# EAGLE design Amiga Parallel SD Rev 3 (EAGLE 9.7.0)
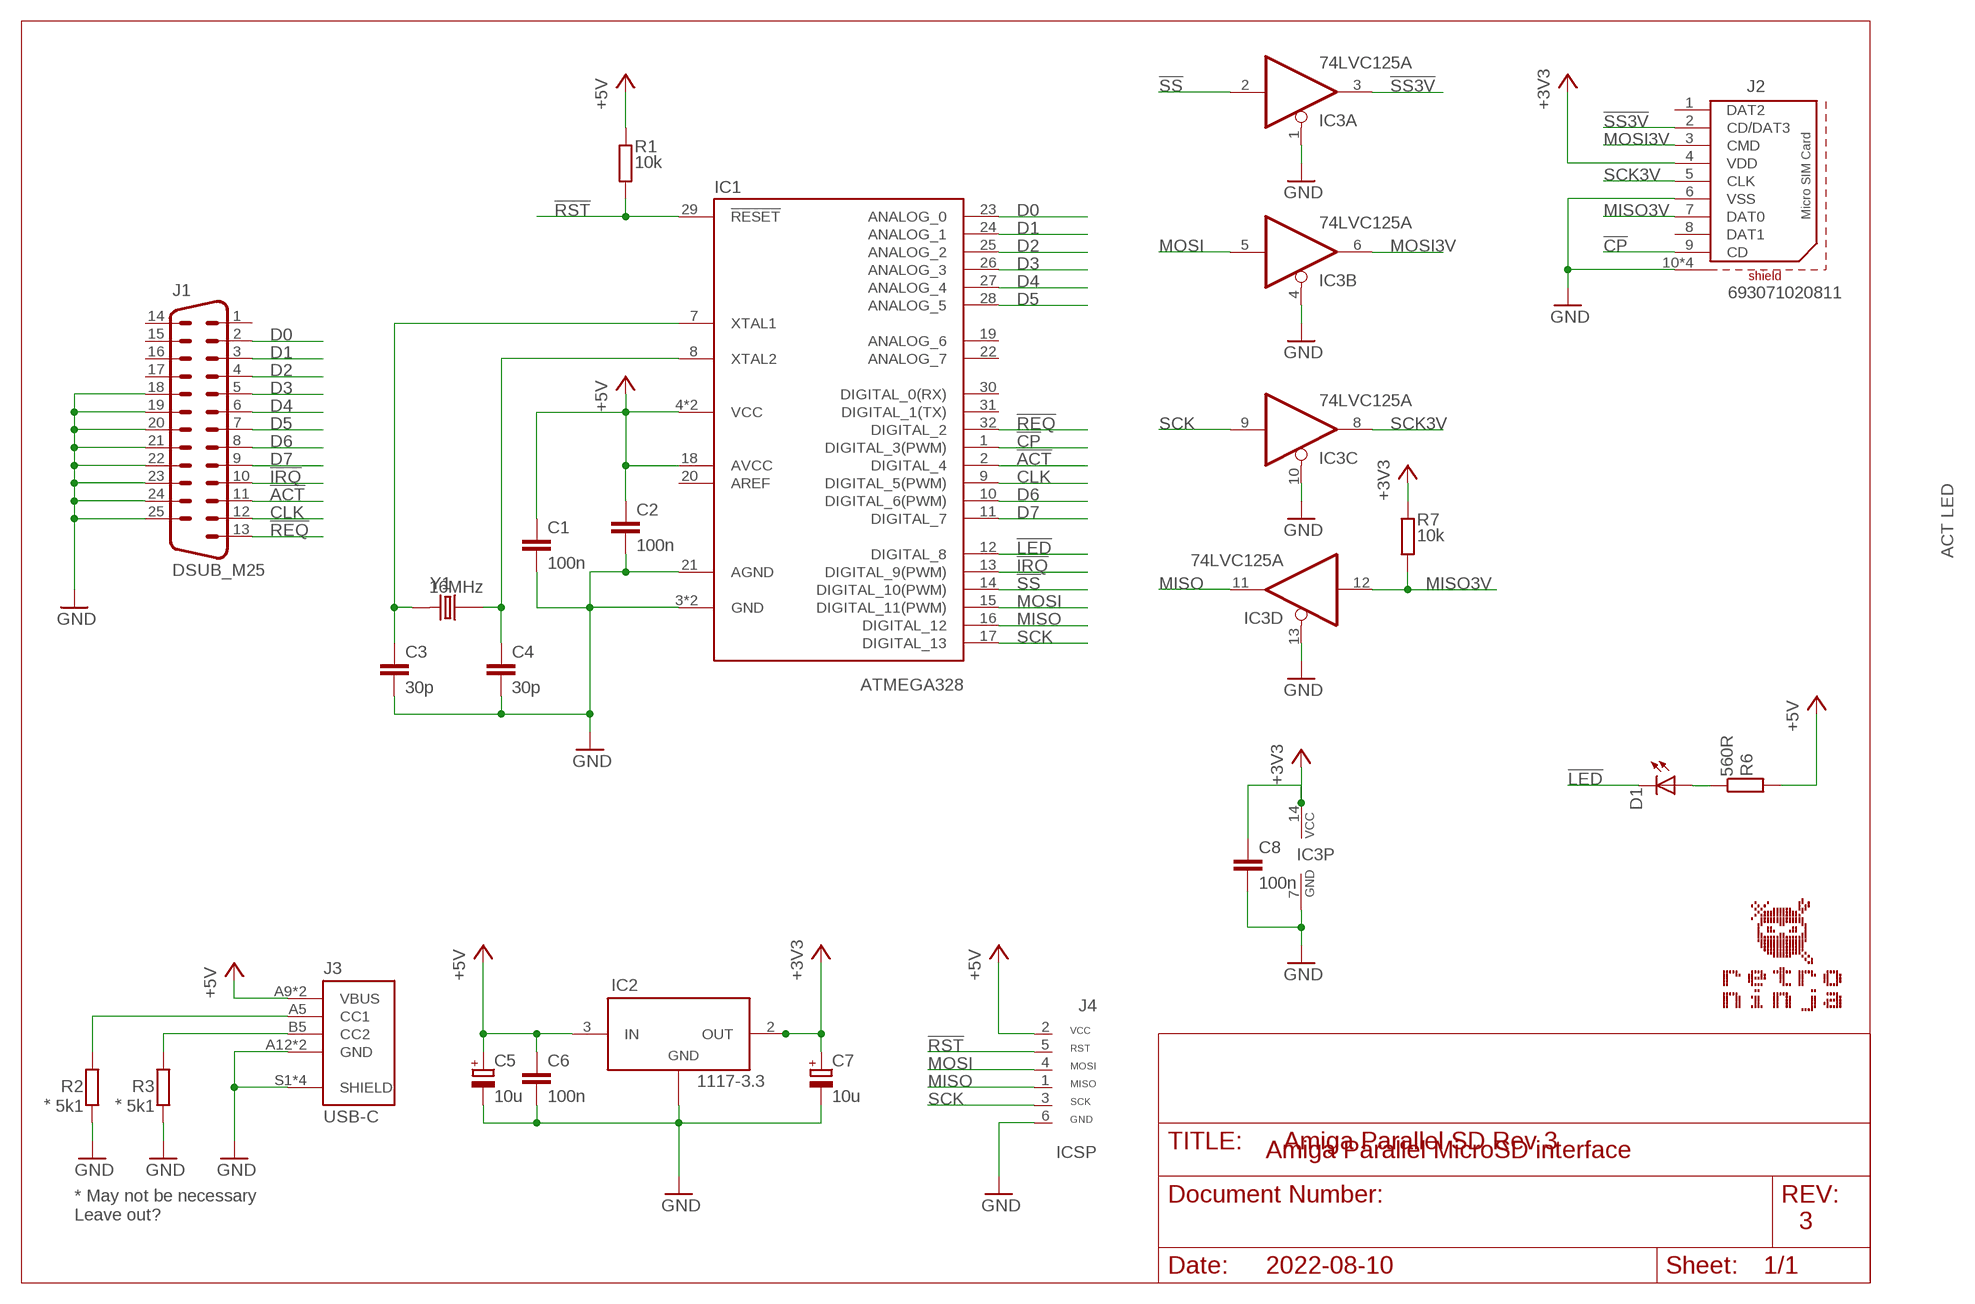
[diagram p0: schematic, sheet 1]

## Parts
C1  100n  C-EUC0805  [C0805]
C2  100n  C-EUC0805  [C0805]
C3  30p  C-EUC0805  [C0805]
C4  30p  C-EUC0805  [C0805]
C5  10u  CAPACITOR_POL_TANT_0805  [TANTALUM_0805]
C6  100n  C-EUC0805  [C0805]
C7  10u  CAPACITOR_POL_TANT_0805  [TANTALUM_0805]
C8  100n  C-EUC0805  [C0805]
D1  LED_3MM_GREEN  [LED3MM_GREEN]
IC1  ATMEGA328  ARDUINO_168_328_TQFP  [TQFP-32]
IC2  1117-3.3  NCP1117ST33T3G  [SOT-223]
IC3  74LVC125A  74HC125D  [SO14]
J1  DSUB_M25  [DSUB_M25D]
J2  693071020811  [693071020811]
J3  USB-C  [MOLEX_2171750001]
J4  ICSP  ICSP_CONNECTOR_6_ALT  [HEADER_2X3_ALT]
R1  10k  R-EU_R0805  [R0805]
R2  5k1  R-EU_R0805  [R0805]
R3  5k1  R-EU_R0805  [R0805]
R6  560R  R-EU_R0805  [R0805]
R7  10k  R-EU_R0805  [R0805]
Y1  16MHz  CRYSTAL  [CRYSTAL_SMD-2_7X4X2.3]

## Nets
!ACT: IC1.2(DIGITAL_4) J1.11
!CP: IC1.1(DIGITAL_3(PWM)) J2.9(CD)
!IRQ: IC1.13(DIGITAL_9(PWM)) J1.10
!LED: D1.K(C) IC1.12(DIGITAL_8)
!REQ: IC1.32(DIGITAL_2) J1.13
!RST: IC1.29(!RESET) J4.5(RST) R1.2
!SS: IC1.14(DIGITAL_10(PWM)) IC3.2(A:I)
!SS3V: IC3.3(A:O) J2.2(CD/DAT3)
+3V3: C7.+ C8.1 IC2.2(OUT) IC2.4 IC3.14(P:VCC) J2.4(VDD) R7.1
+5V: C1.1 C2.1 C5.+ C6.1 IC1.4(VCC) IC1.6(VCC) IC1.18(AVCC) IC2.3(IN) J3.A9(VBUS) J3.B9(VBUS) J4.2(VCC) R1.1 R6.2
A5: J3.A5(CC1) R2.2
B5: J3.B5(CC2) R3.2
CLK: IC1.9(DIGITAL_5(PWM)) J1.12
D0: IC1.23(ANALOG_0) J1.2
D1: IC1.24(ANALOG_1) J1.3
D2: IC1.25(ANALOG_2) J1.4
D3: IC1.26(ANALOG_3) J1.5
D4: IC1.27(ANALOG_4) J1.6
D5: IC1.28(ANALOG_5) J1.7
D6: IC1.10(DIGITAL_6(PWM)) J1.8
D7: IC1.11(DIGITAL_7) J1.9
GND: C1.2 C2.2 C3.2 C4.2 C5.- C6.2 C7.- C8.2 IC1.3(GND) IC1.5(GND) IC1.21(AGND) IC2.1(ADJ/GND) IC3.1(A:OE) IC3.4(B:OE) IC3.7(P:GND) IC3.10(C:OE) IC3.13(D:OE) J1.18 J1.19 J1.20 J1.21 J1.22 J1.23 J1.24 J1.25 J2.6(VSS) J2.10(SHIELD) J2.11(SHIELD) J2.12(SHIELD) J2.13(SHIELD) J3.A12(GND) J3.B12(GND) J3.S1(SHIELD) J3.S2(SHIELD) J3.S3(SHIELD) J3.S4(SHIELD) J4.6(GND) R2.1 R3.1
MISO: IC1.16(DIGITAL_12) IC3.11(D:O) J4.1(MISO)
MISO3V: IC3.12(D:I) J2.7(DAT0) R7.2
MOSI: IC1.15(DIGITAL_11(PWM)) IC3.5(B:I) J4.4(MOSI)
MOSI3V: IC3.6(B:O) J2.3(CMD)
N$2: D1.A R6.1
N$16: C4.1 IC1.8(XTAL2) Y1.1
N$17: C3.1 IC1.7(XTAL1) Y1.2
SCK: IC1.17(DIGITAL_13) IC3.9(C:I) J4.3(SCK)
SCK3V: IC3.8(C:O) J2.5(CLK)
Unconnected: IC1.19(ANALOG_6) IC1.20(AREF) IC1.22(ANALOG_7) IC1.30(DIGITAL_0(RX)) IC1.31(DIGITAL_1(TX)) J1.1 J1.14 J1.15 J1.16 J1.17 J2.1(DAT2) J2.8(DAT1)

## Notes on the sheet
- ACT LED
- * | *
- Amiga Parallel MicroSD interface
- * May not be necessary
  Leave out?
- 3
- 2022-08-10

## Library data of the parts
C1-C4 C6 C8 = rcl:C-EU: CAPACITOR, European symbol; SPICEPREFIX: C
C5 C7 = Per (Fusion 360):CAPACITOR_POL
D1 = Per (Fusion 360):LED
IC1 = Per (Fusion 360):ARDUINO_168_328
IC2 = IC:NCP1117ST33T3G: IC REG LINEAR 3.3V 1A SOT223 Manufacturer's datasheet <https://www.onsemi.com/pub/Collateral/NCP1117-D.PDF>; CREATED_BY: PCBLayout.com; DIGIKEY_PART_NUMBER: NCP1117ST33T3GOSTR-ND; MANUFACTURER: ON Semiconductor; MPN: NCP1117ST33T3G; PACKAGE: SOT-223
IC3 = 74xx-eu:74*125: Quad bus BUFFER, 3-state
J1 = Per (Fusion 360):DSUB_M25
J2 = Wurth_Connectors_WR-CRD:693071020811: WR-CRD Micro SD Card Connector Push & Push 8 pins KIND PROPERTIES Quality Class 10 000 Mating cycles Gender Socket Type Push & Push MATERIAL PROPERTIES Insulator Material LCP Insulator Flammability Rating UL94 V-0 Insulator Color Black Color Black Cover Material Stainless Steel Contact Material Copper Alloy Contact Plating Selective Gold;​ 1 u' on contact area Contact Type Stamped GENERAL INFORMATION Operating Temperature -25 up to +85 °C;​ -40 up to +85 °C Compliance RoHS ELECTRICAL PROPERTIES Working Voltage 100 V (AC);​ 30 V (AC) Withstanding Voltage 500 V (AC) Contact Resistance 100 mΩ Contact Resistance 500 mΩ Details see: https://katalog.we-online.com/en/em/CRD_SD_MICRO_PUSH_AND_PULL_8_PINS Created by Ella Wu 2019-11-05 2019(C) Wurth Elektronik; DATASHEET-URL: https://www.we-online.com/catalog/datasheet/693071020811.pdf; GERDER: Socket; IR: 0.5A; MOUNT: SMT; PART-NUMBER: 693071020811; PINS: 8; TYPE: Push & Push; WORKING-VOLTAGE: 30V(AC)
J3 = Per (Fusion 360):USB-C: Molex 2171750001 USB-C (USB TYPE-C) USB 2.0 Receptacle Connector 24 (6+18 Dummy) Position Surface Mount, Right Angle; Through Hole; MANUFACTURER: Molex; MAXIMUM_PACKAGE_HEIGHT: 3.16mm; PARTREV: A1; STANDARD: Manufacturer Recommendations
J4 = Per (Fusion 360):ICSP_CONNECTOR: PIN HEADER
R1-R3 R6 R7 = rcl:R-EU_: RESISTOR, European symbol; SPICEPREFIX: R
Y1 = Per (Fusion 360):CRYSTAL

## Board
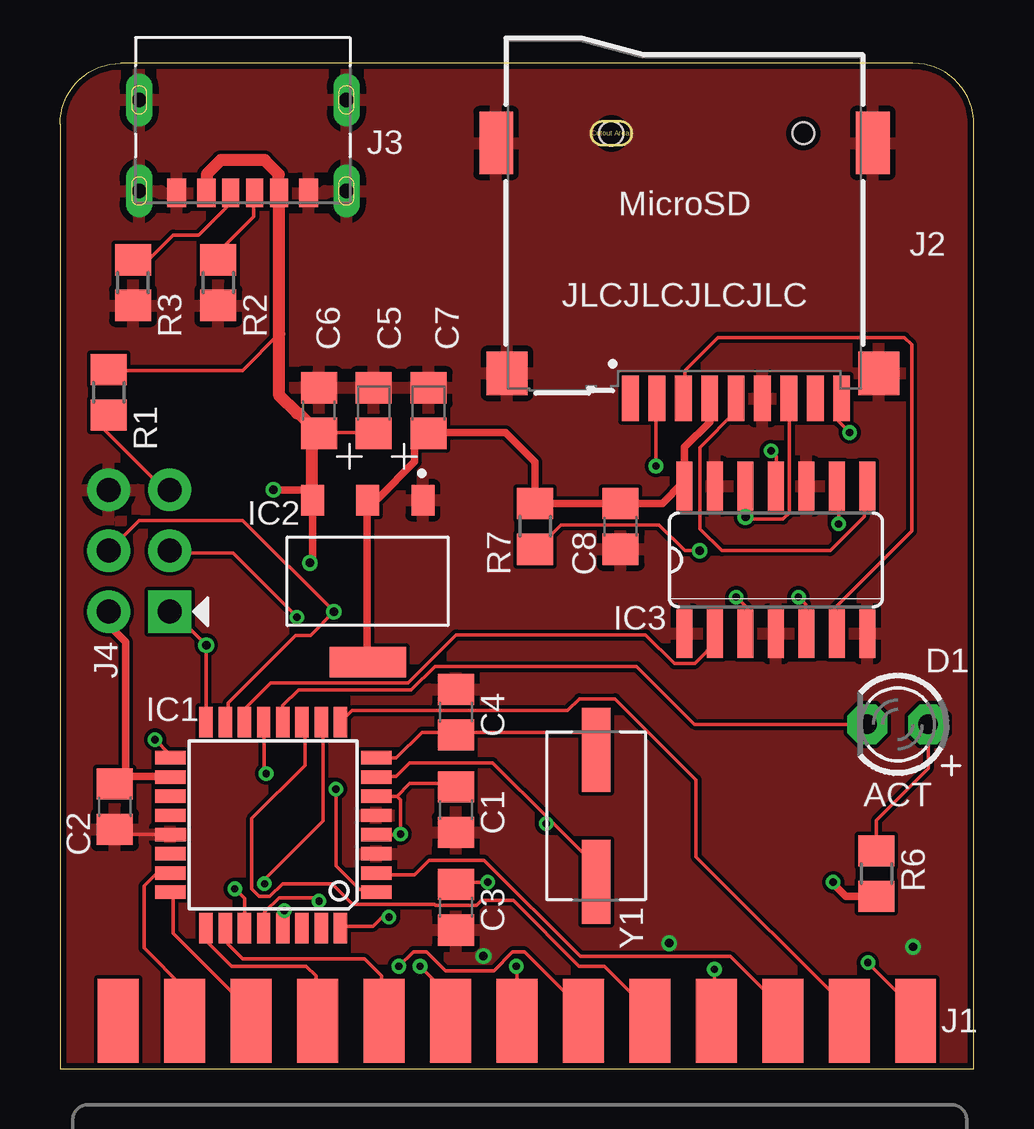
[diagram p1: board, top side]
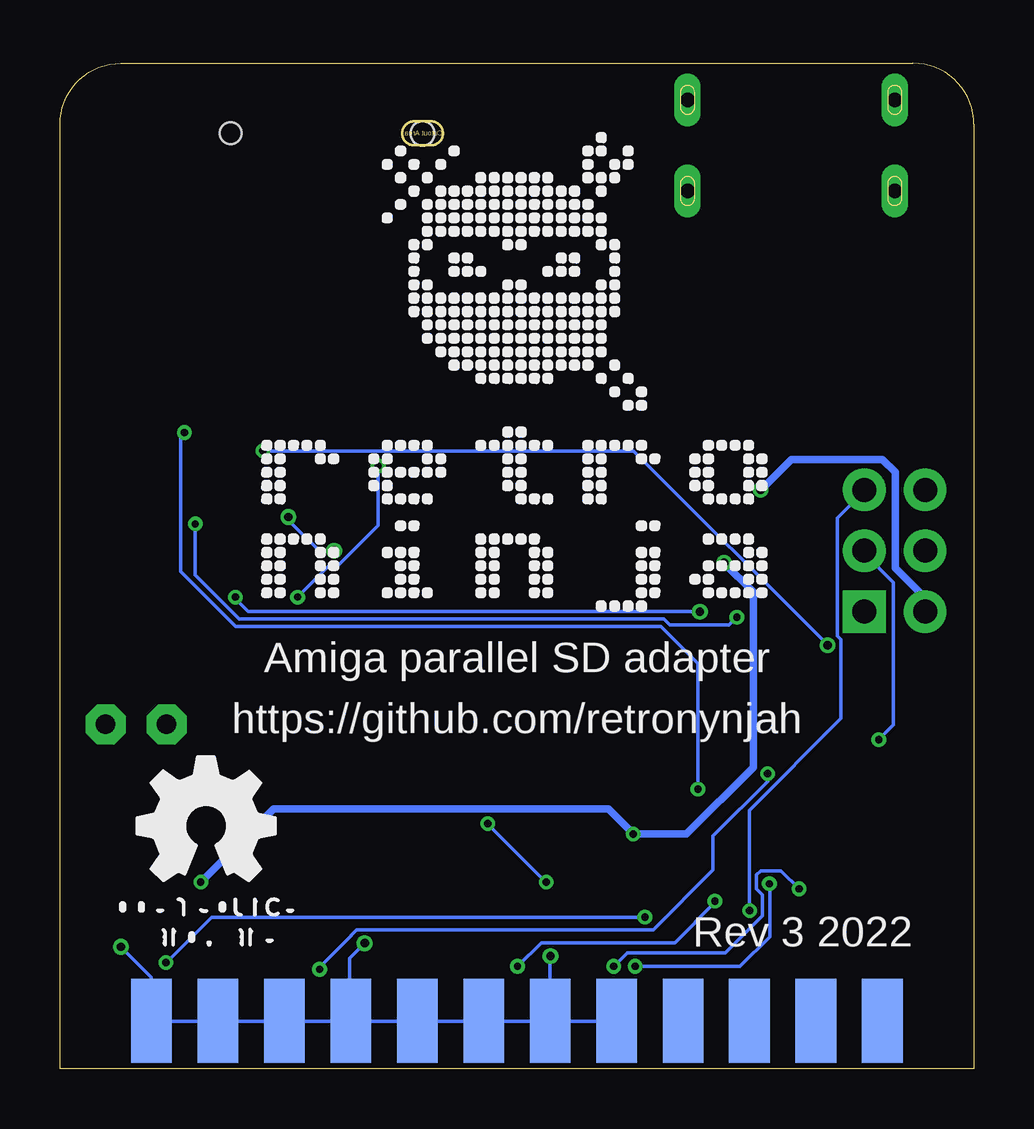
[diagram p2: board, bottom side, seen from below]

Size 38.1 x 41.91 mm. Coordinates in mm from the lower left corner, seen from the top.
Outline: 0,0 38.1,0 38.1,39.37 arc90 35.56,41.91 2.54,41.91 arc90 0,39.37 0,0
Copper layers (1*16): Top 0.035mm / dielectric 1.5mm / Bottom 0.035mm
Design rules "SeeedStudio_2layer_DRU_no_angle_20140221": minimum track width 6mil, minimum drill 12mil, track to track 6mil, track to pad 6mil, pad to pad 6mil, via to via 6mil, smd to smd 0mil, copper to edge 10mil, drill to drill 10mil, minimum pad ring 10mil, minimum via ring 6mil, stop-mask expansion 2mil, vias tented up to drill 100mil, thermal gap 10mil

### Footprints (pad centres in the part's own frame; a part is rotated, then mirrored left to right if it is on the bottom)
C0805 = smd 1.3 x 1.5: 1 -0.95,0; 2 0.95,0
TANTALUM_0805 = smd 1.3 x 1.5: + -0.95,0; - 0.95,0
LED3MM_GREEN = drill 0.813 pad 1.676 octagon: A -1.27,0; K 1.27,0
TQFP-32 = smd 1.27 x 0.559: 1 -4.293,2.8; 2 -4.293,2; 3 -4.293,1.2; 4 -4.293,0.4; 5 -4.293,-0.4; 6 -4.293,-1.2; 7 -4.293,-2; 8 -4.293,-2.8; 17 4.293,-2.8; 18 4.293,-2; 19 4.293,-1.2; 20 4.293,-0.4; 21 4.293,0.4; 22 4.293,1.2; 23 4.293,2; 24 4.293,2.8 | smd 0.559 x 1.27: 9 -2.8,-4.293; 10 -2,-4.293; 11 -1.2,-4.293; 12 -0.4,-4.293; 13 0.4,-4.293; 14 1.2,-4.293; 15 2,-4.293; 16 2.8,-4.293; 25 2.8,4.293; 26 2,4.293; 27 1.2,4.293; 28 0.4,4.293; 29 -0.4,4.293; 30 -1.2,4.293; 31 -2,4.293; 32 -2.8,4.293
SOT-223 = smd 1.26 x 0.96: 1 -3.375,2.3; 2 -3.375,0; 3 -3.375,-2.3 | smd 1.26 x 3.19: 4 3.375,0
SO14 = smd 0.66 x 2.032: 1 -3.81,-3.073; 2 -2.54,-3.073; 3 -1.27,-3.073; 4 0,-3.073; 5 1.27,-3.073; 6 2.54,-3.073; 7 3.81,-3.073; 8 3.81,3.073; 9 2.54,3.073; 10 1.27,3.073; 11 0,3.073; 12 -1.27,3.073; 13 -2.54,3.073; 14 -3.81,3.073
DSUB_M25D = smd 1.7 x 3.5: 1 16.62,-9.855; 2 13.85,-9.855; 3 11.08,-9.855; 4 8.31,-9.855; 5 5.54,-9.855; 6 2.77,-9.855; 7 0,-9.855; 8 -2.77,-9.855; 9 -5.54,-9.855; 10 -8.31,-9.855; 11 -11.08,-9.855; 12 -13.85,-9.855; 13 -16.62,-9.855 | smd 1.7 x 3.5 bottom: 14 15.235,-9.855; 15 12.465,-9.855; 16 9.695,-9.855; 17 6.925,-9.855; 18 4.155,-9.855; 19 1.385,-9.855; 20 -1.385,-9.855; 21 -4.155,-9.855; 22 -6.925,-9.855; 23 -9.695,-9.855; 24 -12.465,-9.855; 25 -15.235,-9.855
693071020811 = smd 0.7 x 1.9: 1 2.25,11.05; 2 1.15,11.05; 3 0.05,11.05; 4 -1.05,11.05; 5 -2.15,11.05; 6 -3.25,11.05; 7 -4.35,11.05; 8 -5.45,11.05; 9 -6.55,11.05 | smd 1.7 x 1.8: 10 -8.1,10; 11 7.4,10 | smd 1.4 x 2.6: 12 -7.85,0.4; 13 7.85,0.4 | hole 0.9: -4.95,0 | hole 1: 3.05,0
MOLEX_2171750001 = smd 0.7 x 1.2: A5 -0.5,3.88; B5 0.5,3.88 | smd 0.76 x 1.2: A9 1.52,3.88; B9 -1.52,3.88 | smd 0.8 x 1.2: A12 2.75,3.88; B12 -2.75,3.88 | drill 0.6 pad 1.1 long: S1 -4.32,0; S2 4.32,0; S3 -4.32,3.8; S4 4.32,3.8
HEADER_2X3_ALT = drill 1 pad 1.778 square: 1 -2.54,-1.27 | drill 1 pad 1.778: 2 -2.54,1.27; 3 0,-1.27; 4 0,1.27; 5 2.54,-1.27; 6 2.54,1.27
R0805 = smd 1.3 x 1.5: 1 -0.95,0; 2 0.95,0
CRYSTAL_SMD-2_7X4X2.3 = smd 3.5 x 1.2: 1 -2.75,0; 2 2.75,0

### Placement (x,y rotation side)
C1  16.51,10.79 270 top
C2  2.29,10.92 270 top
C3  16.51,6.73 270 top
C4  16.51,14.86 90 top
C5  13.08,27.43 90 top
C6  10.79,27.43 90 top
C7  15.37,27.43 90 top
C8  23.37,22.61 270 top
D1  34.92,14.35 180 top
IC1  8.89,10.16 180 top
IC2  12.83,20.32 270 top
IC3  29.84,21.21 0 top
J1  19.05,-7.85 180 top
J2  26.04,38.99 180 top
J3  7.62,40.39 180 top
J4  3.3,21.59 90 top
R1  2.03,28.19 270 top
R2  6.6,32.77 90 top
R3  3.05,32.77 90 top
R6  34.04,8.13 270 top
R7  19.81,22.61 270 top
U$1  [RETRONINJA_20MM]  29.72,19.05 0 bottom
U$2  [OSHW_8MM]  35.81,5.08 0 bottom
Y1  22.35,10.54 270 top

### Tracks (layer width: path | path; a pad name or v marks a point on that pad's centre or on a via)
!ACT
  Top 0.152: IC1.2 13.26,8.08 14.78,8.08 15.39,8.69 17.68,8.69 21.69,4.67 27.94,4.67 30.02,2.59 30.02,2.13 J1.11
!CP  (via drill 0.3)
  Top 0.152: v32.92,26.52 32.46,26.98 32.46,27.89 J2.9 | IC1.1 13.11,7.47 12.5,7.47 11.51,8.46 v11.51,11.66
  Bottom 0.152: v32.92,26.52 33.07,26.36 33.07,20.73 30.79,18.44 13.05,18.44 11.51,16.9 v11.51,11.66
!IRQ  (via drill 0.3)
  Top 0.152: J1.10 27.28,2.08 v27.28,4.14 | IC1.13 8.51,14.43 8.51,12.39 v8.59,12.3
  Bottom 0.152: v27.28,4.14 27.28,4.22 25.96,5.54 25.96,5.56 25.73,5.79 13.37,5.79 10.87,8.28 10.87,9.7 8.59,11.98 v8.59,12.3
!LED
  Top 0.152: IC1.12 9.29,15.13 9.94,15.78 14.64,15.78 15.62,16.76 24.04,16.76 26.45,14.35 D1.K
!REQ  (via drill 0.3)
  Top 0.152: v33.68,4.42 35.66,2.44 35.66,2.13 J1.13 | IC1.32 11.73,5.94 13.06,5.94 13.43,6.32 v13.72,6.32
  Bottom 0.152: v33.68,4.42 31.78,6.32 v13.72,6.32
!RST  (via drill 0.3)
  Top 0.152: R1.2 1.83,27.13 1.83,26.67 4.27,24.23 4.57,24.23 J4.5 | IC1.29 9.3,6.54 v9.35,6.59
  Bottom 0.152: J4.5 4.57,24.08 5.69,22.96 5.69,18.03 5.54,17.88 5.54,14.6 9.37,10.78 9.37,6.61 v9.35,6.59
!SS
  Top 0.152: IC1.14 7.77,14.48 7.77,15.09 8.77,16.09 14.52,16.09 16.52,18.09 24.42,18.09 25.61,16.89 26.46,16.89 27.43,17.86 27.43,18.14 IC3.2
!SS3V  (via drill 0.3)
  Top 0.152: v24.84,25.12 24.84,27.89 J2.2 | v28.19,19.66 28.65,19.2 28.65,18.14 IC3.3
  Bottom 0.152: v28.19,19.66 26.82,21.03 26.44,21.03 24.84,22.63 v24.84,25.12
+3V3
  Top 0.152: 13.26,23.77 12.95,23.77 IC2.2 12.8,23.62 | 15.24,26.36 C7.+ 15.39,26.52 | 12.8,17.07 IC2.4 | 25.93,24.38 IC3.14
  Top 0.305: 13.26,23.77 14.78,25.3 14.78,25.91 15.24,26.36 | 12.8,23.62 12.8,17.07 | J2.4 27.09,26.96 26.04,25.91 IC3.14 | 15.39,26.52 18.57,26.52 19.81,25.28 R7.1 C8.1 25.11,23.56 25.93,24.38
+5V  (via drill 0.3, 0.35)
  Top 0.152: 6.12,36.52 J3.A9 | 9.12,36.52 J3.B9 9.14,36.42 | 10.52,23.77 IC2.3 10.09,24.13 | C6.1 10.67,26.36 10.52,26.21 C6.1 | R1.1 1.83,29.11 7.62,29.11 9.14,30.63 | C5.+ 12.95,26.52 10.82,26.52 C6.1 | IC1.4 13.26,9.75 14.17,9.75 v14.2,9.78 14.2,11.21 14.05,11.36 | C1.1 16.46,11.89 14.58,11.89 14.05,11.36 | 4.57,12.19 IC1.18 | v10.41,21.08 10.53,21.2 | 14.05,11.36 IC1.6 | 32.23,7.71 v32.23,7.77 | 2.59,12.19 2.74,12.19 C2.1 2.29,11.89 2.59,12.19
  Top 0.305: 4.57,12.19 2.74,12.19 2.74,17.78 2.03,18.49 J4.2 | 10.53,21.2 IC2.3 | v8.89,24.13 10.09,24.13 | R6.2 32.77,7.18 32.23,7.71
  Top 0.508: 6.12,36.52 6.12,37.29 6.71,37.87 8.53,37.87 9.12,37.29 9.12,36.52 | 9.14,36.42 9.14,30.63 9.14,28.06 9.88,27.33 9.95,27.33 C6.1 10.52,26.2 10.52,23.77
  Bottom 0.305: v32.23,7.77 29.18,10.82 15.24,10.82 v14.2,9.78 11.98,9.78 9.2,12.55 9.2,19.87 v10.41,21.08 | J4.2 2.03,19.63 3.28,20.87 3.28,24.87 3.81,25.4 7.62,25.4 v8.89,24.13
A5
  Top 0.152: J3.A5 8.08,36.42 8.08,35.51 6.71,34.14 6.71,33.83 R2.2
B5
  Top 0.152: J3.B5 7.01,36.42 7.01,35.97 5.79,34.75 4.72,34.75 3.81,33.83 3.05,33.83 R3.2
CLK
  Top 0.152: J1.12 32.77,2.13 32.77,2.59 26.52,8.84 26.52,12.04 23.14,15.42 21.65,15.42 21.16,14.93 16.51,14.93 12.17,14.93 IC1.9
D0
  Top 0.152: IC1.23 4.57,8.08 3.96,8.08 3.5,7.62 3.5,5.03 5.18,3.35 5.18,2.13 J1.2
D1
  Top 0.152: IC1.24 4.72,7.32 4.72,5.64 7.92,2.44 7.92,2.13 J1.3
D2
  Top 0.152: IC1.25 6.1,5.79 6.1,5.33 7.16,4.27 10.26,4.27 10.67,3.86 10.67,2.13 J1.4
D3
  Top 0.152: IC1.26 7.01,5.79 7.01,5.18 7.62,4.57 12.7,4.57 13.41,3.86 13.41,2.13 J1.5
D4  (via drill 0.3)
  Top 0.152: v15.01,4.27 16.15,3.12 16.15,2.13 J1.6 | v7.28,7.5 7.69,7.09 IC1.27
  Bottom 0.152: v15.01,4.27 14.45,4.83 10.37,4.83 8.82,6.37 8.82,7.25 9.06,7.49 9.06,8.08 8.89,8.26 8.04,8.26 v7.28,7.5
D5  (via drill 0.3)
  Top 0.152: v19.02,4.27 19.05,4.24 J1.7 | IC1.28 8.53,5.91 8.53,6.53 9.13,7.13 10.66,7.13 v10.8,6.99
  Bottom 0.152: v19.02,4.27 18.04,5.25 12.47,5.25 10.8,6.93 v10.8,6.99
D6  (via drill 0.3)
  Top 0.152: v14.12,4.27 14.73,4.88 15.29,4.88 16.08,4.09 18.09,4.09 18.87,4.88 19.36,4.88 21.79,2.44 21.79,2.13 J1.8 | IC1.10 10.97,14.33 10.97,10.33 8.53,7.88 v8.53,7.71
  Bottom 0.152: v14.12,4.27 9.75,4.27 8.52,5.51 8.52,7.7 v8.53,7.71
D7
  Top 0.152: IC1.11 10.21,14.33 10.21,12.65 8,10.43 8,7.49 8.31,7.17 8.75,7.17 9.28,7.7 11.35,7.7 12.2,6.85 15.62,6.85 15.66,6.8 17.36,6.8 17.56,7.01 18.9,7.01 21.64,4.27 22.71,4.27 24.54,2.44 24.54,2.13 J1.9
GND  (via drill 0.35)
  Top 0.152: IC1.21 2.5,9.76 C2.2
  Bottom 0.152: J1.22 26.06,1.98 28.65,1.98 J1.23 28.8,1.98 31.39,1.98 J1.24 31.55,1.98 34.14,1.98 J1.25 34.29,3.81 v35.56,5.08 | J1.18 14.94,1.98 17.53,1.98 J1.19 | J1.19 17.68,1.98 20.42,1.98 J1.20 20.57,1.98 23.16,1.98 J1.21 23.32,1.98 25.91,1.98 J1.22 | J1.19 17.66,4.69 v17.65,4.7 | J1.22 26.04,2.06 26.04,4.59 v25.4,5.23
  pour Top: 0.25,0.25 37.85,0.25 37.85,41.66 0.25,41.66
MISO  (via drill 0.3, 0.35)
  Top 0.152: IC1.16 6.1,14.48 v6.1,17.65 4.7,19.05 J4.1 | v29.64,25.76 29.87,25.53 29.87,24.38 IC3.11
  Bottom 0.152: v29.64,25.76 14.2,25.76 v6.1,17.65
MISO3V  (via drill 0.35)
  Top 0.152: IC3.12 v28.57,22.99 28.66,22.91 30.14,22.91 30.4,23.17 30.4,27.92 J2.7 | v26.67,21.59 26.05,21.59 24.98,22.66 20.88,22.66 19.88,21.66 R7.2
  Bottom 0.152: v26.67,21.59 27.3,21.59 28.57,22.86 v28.57,22.99
MOSI  (via drill 0.3, 0.35)
  Top 0.152: v30.79,19.66 31.09,19.36 31.09,18.14 IC3.5 | IC1.15 7.01,14.57 7.01,15.24 9.83,18.06 10.44,18.06 v11.43,19.05 | v11.43,19.05 v11.42,19.05 | J4.4 3.3,22.86 7.62,22.86 v11.43,19.05
  Bottom 0.152: v30.79,19.66 30.79,19.58 30.25,19.05 v11.42,19.05
MOSI3V
  Top 0.152: J2.3 26.06,28.04 26.06,29.11 27.43,30.48 35.2,30.48 35.51,30.18 35.51,22.4 32.31,19.2 32.31,18.14 IC3.6
N$2
  Top 0.152: R6.1 34.04,10.35 36.2,12.51 D1.A
N$16
  Top 0.152: IC1.8 13.26,12.95 14.02,12.95 15.09,14.02 16.46,14.02 C4.1 16.61,14.02 21.79,14.02 22.4,13.41 Y1.1
N$17  (via drill 0.3)
  Top 0.152: 20.42,10.36 22.25,8.53 22.25,7.92 Y1.2 | IC1.7 13.26,12.19 14.02,12.19 14.58,12.75 18.03,12.75 20.42,10.36 | v17.83,7.77 16.61,7.77 C3.1 | 20.42,10.36 v20.27,10.21
  Bottom 0.152: v20.27,10.21 v17.83,7.77
SCK  (via drill 0.3)
  Top 0.152: v3.96,13.72 4.57,13.11 IC1.17 | v32.46,22.71 32.46,24.23 IC3.9 | v9.88,18.82 7.21,21.49 4.57,21.49 J4.3
  Bottom 0.152: v3.96,13.72 3.35,14.33 3.35,20.27 4.57,21.49 J4.3 | v32.46,22.71 32.46,20.57 30.63,18.75 12.92,18.75 12.67,18.49 10.21,18.49 v9.88,18.82
SCK3V
  Top 0.152: J2.5 28.19,27.89 28.19,27.43 26.67,25.9 26.67,22.5 27.58,21.59 32.11,21.59 33.53,23.01 33.53,24.23 IC3.8

### Text on the board
tPlace: MicroSD | JLCJLCJLCJLC | ACT
bPlace: Amiga parallel SD adapter | https://github.com/retronynjah | Rev 3 2022
LAYER_130: ATmega / 328